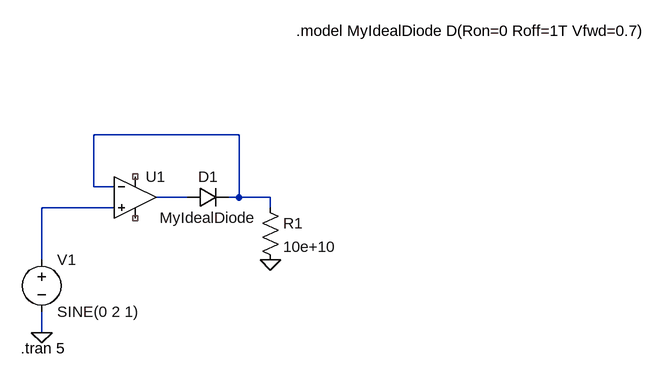
[diagram p0: schematic simple_halfwave_rectifier.asc]
simple_halfwave_rectifier.asc, the LTspice schematic file:
Version 4
SHEET 1 1084 680
WIRE 352 -128 128 -128
WIRE 128 -48 128 -128
WIRE 160 -48 128 -48
WIRE 272 -32 224 -32
WIRE 352 -32 352 -128
WIRE 352 -32 336 -32
WIRE 400 -32 352 -32
WIRE 160 -16 48 -16
WIRE 400 -16 400 -32
WIRE 48 64 48 -16
WIRE 48 176 48 144
FLAG 48 176 0
FLAG 400 64 0
SYMBOL voltage 48 48 R0
WINDOW 123 0 0 Left 0
WINDOW 39 0 0 Left 0
SYMATTR InstName V1
SYMATTR Value SINE(0 2 1)
SYMBOL OpAmps\\UniversalOpAmp 192 -32 R0
SYMATTR InstName U1
SYMBOL diode 272 -16 R270
WINDOW 0 32 32 VTop 2
WINDOW 3 0 32 VBottom 2
SYMATTR InstName D1
SYMATTR Value MyIdealDiode
SYMBOL res 384 -32 R0
SYMATTR InstName R1
SYMATTR Value 10e+10
TEXT 16 200 Left 2 !.tran 5
TEXT 440 -288 Left 2 !.model MyIdealDiode D(Ron=0 Roff=1T Vfwd=0.7)

The netlist it stands for:
* simple_halfwave_rectifier.asc
V1 N003 0 SINE(0 2 1)
XU1 N003 N001 NC_01 NC_02 N002 level1 Avol=1Meg GBW=10Meg Vos=0 En=0 Enk=0 In=0 Ink=0 Rin=500Meg  ; pins In+ In- V+ V- OUT
D1 N002 N001 MyIdealDiode
R1 N001 0 10e+10
.model D D
.lib standard.dio
.tran 5
.model MyIdealDiode D(Ron=0 Roff=1T Vfwd=0.7)
.lib UniversalOpAmp1.lib
.backanno
.end